# EAGLE design ders1 (EAGLE 9.6.2)
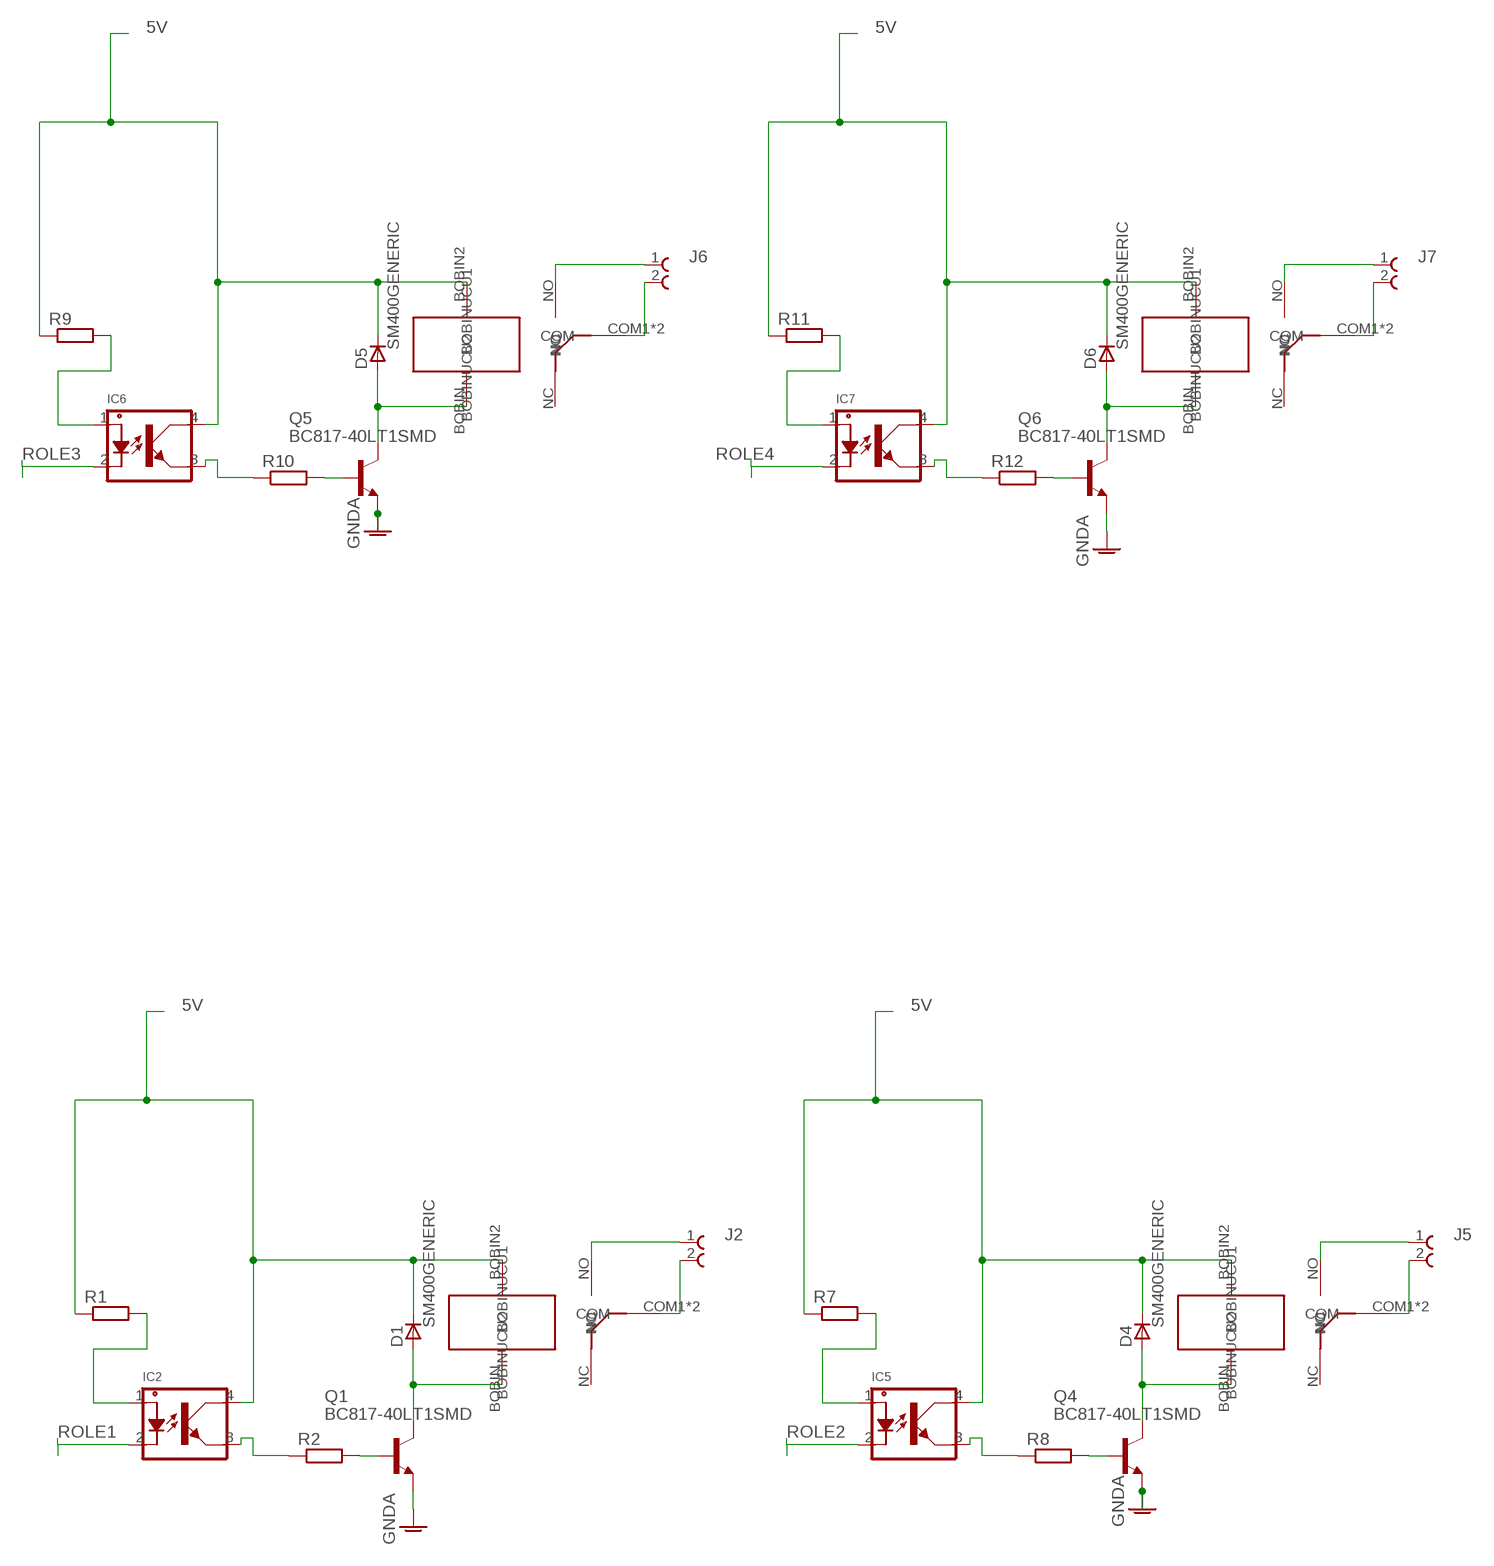
[diagram p0: schematic, sheet 1, part 1 of 2]
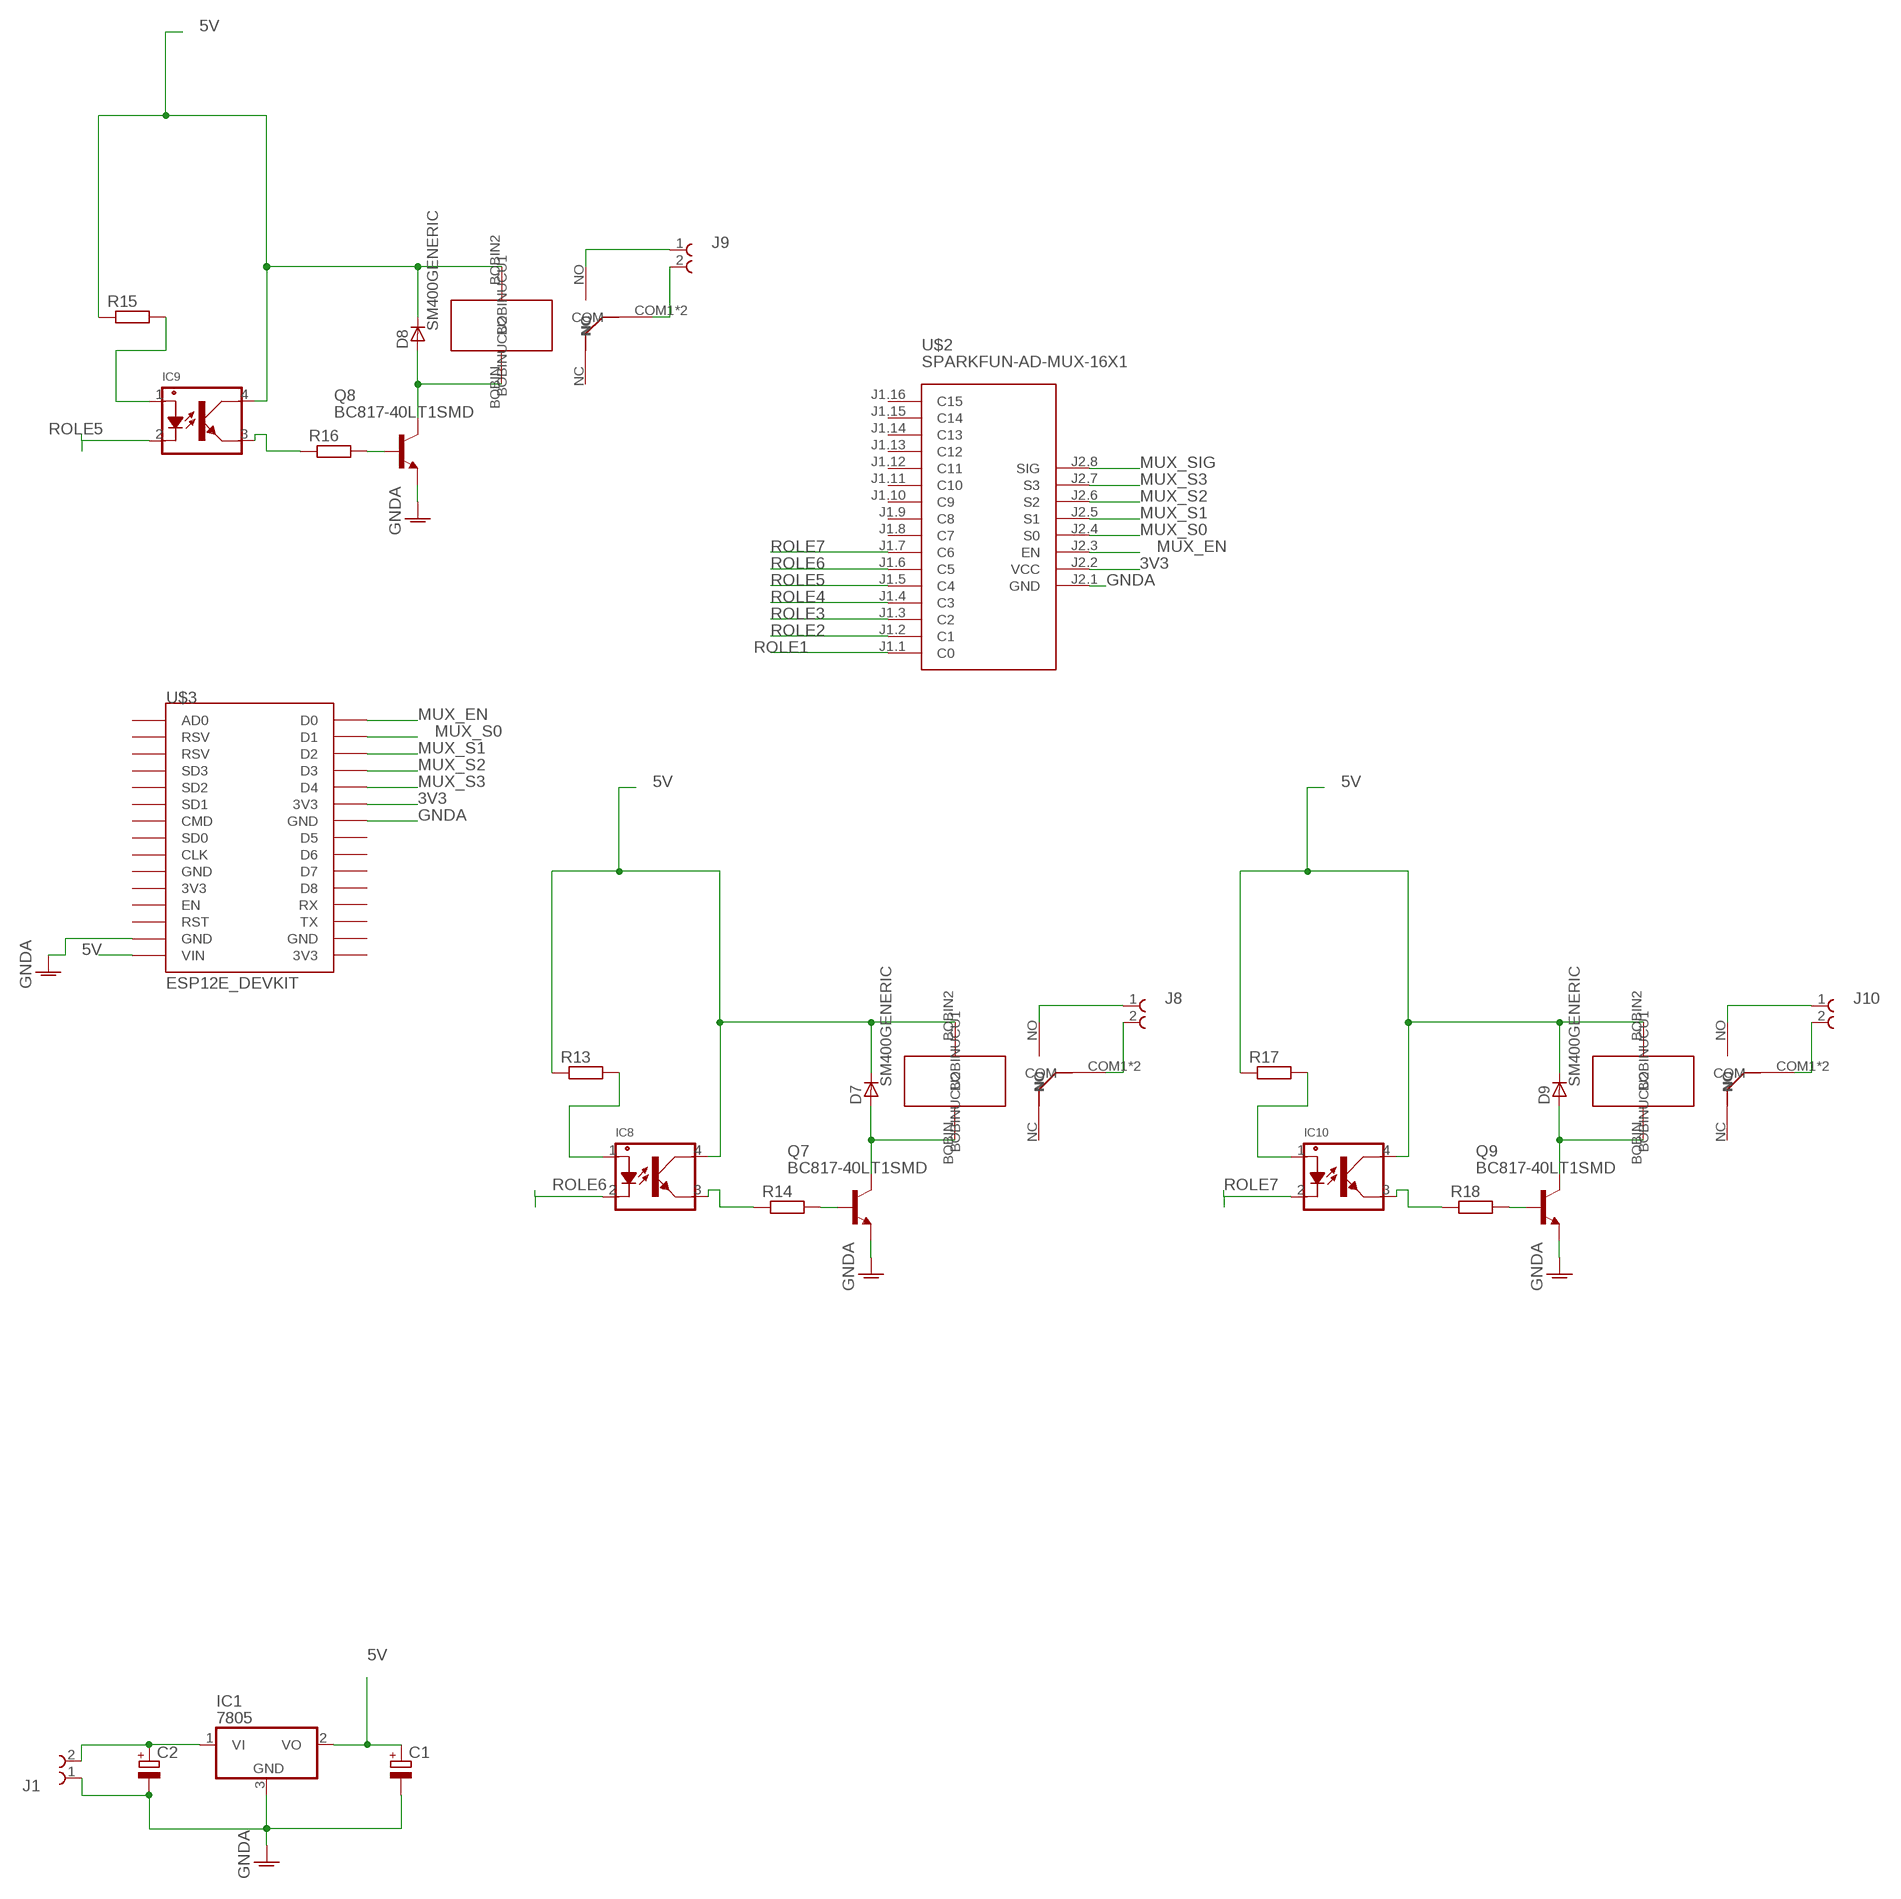
[diagram p1: schematic, sheet 1, part 2 of 2]

## Parts
C1  CPOL-EU153CLV-0405  [153CLV-0405]
C2  CPOL-EU153CLV-0405  [153CLV-0405]
D1  SM400GENERIC  [MELF-MLL41_DO213AB]
D4  SM400GENERIC  [MELF-MLL41_DO213AB]
D5  SM400GENERIC  [MELF-MLL41_DO213AB]
D6  SM400GENERIC  [MELF-MLL41_DO213AB]
D7  SM400GENERIC  [MELF-MLL41_DO213AB]
D8  SM400GENERIC  [MELF-MLL41_DO213AB]
D9  SM400GENERIC  [MELF-MLL41_DO213AB]
IC1  7805  [TO252]
IC2  LTV-817SMD  [SMD-4]
IC5  LTV-817SMD  [SMD-4]
IC6  LTV-817SMD  [SMD-4]
IC7  LTV-817SMD  [SMD-4]
IC8  LTV-817SMD  [SMD-4]
IC9  LTV-817SMD  [SMD-4]
IC10  LTV-817SMD  [SMD-4]
J1  691701540002B  [691701540002B]
J2  691701540002B  [691701540002B]
J5  691701540002B  [691701540002B]
J6  691701540002B  [691701540002B]
J7  691701540002B  [691701540002B]
J8  691701540002B  [691701540002B]
J9  691701540002B  [691701540002B]
J10  691701540002B  [691701540002B]
Q1  BC817-40LT1SMD  [SOT23-BEC]
Q4  BC817-40LT1SMD  [SOT23-BEC]
Q5  BC817-40LT1SMD  [SOT23-BEC]
Q6  BC817-40LT1SMD  [SOT23-BEC]
Q7  BC817-40LT1SMD  [SOT23-BEC]
Q8  BC817-40LT1SMD  [SOT23-BEC]
Q9  BC817-40LT1SMD  [SOT23-BEC]
R1  R-EU_R1206  [R1206]
R2  R-EU_R1206  [R1206]
R7  R-EU_R1206  [R1206]
R8  R-EU_R1206  [R1206]
R9  R-EU_R1206  [R1206]
R10  R-EU_R1206  [R1206]
R11  R-EU_R1206  [R1206]
R12  R-EU_R1206  [R1206]
R13  R-EU_R1206  [R1206]
R14  R-EU_R1206  [R1206]
R15  R-EU_R1206  [R1206]
R16  R-EU_R1206  [R1206]
R17  R-EU_R1206  [R1206]
R18  R-EU_R1206  [R1206]
U$1  HK23F-DC5V-SHG  [HK23F]
U$2  SPARKFUN-AD-MUX-16X1  [SPARKFUN-AD-MUX-16X1]
U$3  ESP12E_DEVKIT  [ESP12E_DEVKIT]
U$4  HK23F-DC5V-SHG  [HK23F]
U$5  HK23F-DC5V-SHG  [HK23F]
U$6  HK23F-DC5V-SHG  [HK23F]
U$7  HK23F-DC5V-SHG  [HK23F]
U$8  HK23F-DC5V-SHG  [HK23F]
U$9  HK23F-DC5V-SHG  [HK23F]

## Nets
3V3: U$2.J2.2(VCC) U$3.3V3@1(3V3)
5V: C1.+ D1.C D4.C D5.C D6.C D7.C D8.C D9.C IC1.2(VO) IC2.4 IC5.4 IC6.4 IC7.4 IC8.4 IC9.4 IC10.4 R1.1 R7.1 R9.1 R11.1 R13.1 R15.1 R17.1 U$1.BOBIN2(BOBINUCU2) U$3.VIN U$4.BOBIN2(BOBINUCU2) U$5.BOBIN2(BOBINUCU2) U$6.BOBIN2(BOBINUCU2) U$7.BOBIN2(BOBINUCU2) U$8.BOBIN2(BOBINUCU2) U$9.BOBIN2(BOBINUCU2)
GNDA: C1.- C2.- IC1.3(GND) J1.1 Q1.E Q4.E Q5.E Q6.E Q7.E Q8.E Q9.E U$2.J2.1(GND) U$3.GND@1(GND) U$3.GND@2(GND)
MUX_EN: U$2.J2.3(EN) U$3.D0
MUX_S0: U$2.J2.4(S0) U$3.D1
MUX_S1: U$2.J2.5(S1) U$3.D2
MUX_S2: U$2.J2.6(S2) U$3.D3
MUX_S3: U$2.J2.7(S3) U$3.D4
MUX_SIG: U$2.J2.8(SIG)
N$1: C2.+ IC1.1(VI) J1.2
N$3: D1.A Q1.C U$1.BOBIN(BOBINUCU1)
N$4: Q1.B R2.2
N$5: IC2.3 R2.1
N$6: IC2.1 R1.2
N$7: J2.2 U$1.COM1(COM) U$1.COM2(COM)
N$8: J2.1 U$1.NO
N$15: D4.A Q4.C U$4.BOBIN(BOBINUCU1)
N$22: Q4.B R8.2
N$23: IC5.3 R8.1
N$24: IC5.1 R7.2
N$25: J5.2 U$4.COM1(COM) U$4.COM2(COM)
N$26: J5.1 U$4.NO
N$27: D5.A Q5.C U$5.BOBIN(BOBINUCU1)
N$28: Q5.B R10.2
N$29: IC6.3 R10.1
N$30: IC6.1 R9.2
N$31: J6.2 U$5.COM1(COM) U$5.COM2(COM)
N$32: J6.1 U$5.NO
N$33: D6.A Q6.C U$6.BOBIN(BOBINUCU1)
N$34: Q6.B R12.2
N$35: IC7.3 R12.1
N$36: IC7.1 R11.2
N$37: J7.2 U$6.COM1(COM) U$6.COM2(COM)
N$38: J7.1 U$6.NO
N$39: D7.A Q7.C U$7.BOBIN(BOBINUCU1)
N$40: Q7.B R14.2
N$41: IC8.3 R14.1
N$42: IC8.1 R13.2
N$43: J8.2 U$7.COM1(COM) U$7.COM2(COM)
N$44: J8.1 U$7.NO
N$45: D8.A Q8.C U$8.BOBIN(BOBINUCU1)
N$46: Q8.B R16.2
N$47: IC9.3 R16.1
N$48: IC9.1 R15.2
N$49: J9.2 U$8.COM1(COM) U$8.COM2(COM)
N$50: J9.1 U$8.NO
N$51: D9.A Q9.C U$9.BOBIN(BOBINUCU1)
N$52: Q9.B R18.2
N$53: IC10.3 R18.1
N$54: IC10.1 R17.2
N$55: J10.2 U$9.COM1(COM) U$9.COM2(COM)
N$56: J10.1 U$9.NO
ROLE1: IC2.2 U$2.J1.1(C0)
ROLE2: IC5.2 U$2.J1.2(C1)
ROLE3: IC6.2 U$2.J1.3(C2)
ROLE4: IC7.2 U$2.J1.4(C3)
ROLE5: IC9.2 U$2.J1.5(C4)
ROLE6: IC8.2 U$2.J1.6(C5)
ROLE7: IC10.2 U$2.J1.7(C6)
Unconnected: U$1.NC U$2.J1.8(C7) U$2.J1.9(C8) U$2.J1.10(C9) U$2.J1.11(C10) U$2.J1.12(C11) U$2.J1.13(C12) U$2.J1.14(C13) U$2.J1.15(C14) U$2.J1.16(C15) U$3.3V3@0(3V3) U$3.3V3@2(3V3) U$3.AD0 U$3.CLK U$3.CMD U$3.D5 U$3.D6 U$3.D7 U$3.D8 U$3.EN U$3.GND@0(GND) U$3.GND@3(GND) U$3.RST U$3.RSV@0(RSV) U$3.RSV@1(RSV) U$3.RX U$3.SD0 U$3.SD1 U$3.SD2 U$3.SD3 U$3.TX U$4.NC U$5.NC U$6.NC U$7.NC U$8.NC U$9.NC

## Library data of the parts
C1 C2 = rcl:CPOL-EU: POLARIZED CAPACITOR, European symbol; SPICEPREFIX: C
D1 D4-D9 = _hhn_diodes_smd:SM400*: SM4001 .. SM4007 General Purpose Rectifier, 1 A SMD-Version of 1N4001 .. 1N4007 Case: MELF-MLL41 = DO 213 AB Author: Dipl.-Ing. FH Rainer Bayer HHN Hochschule Heilbronn, rainer.bayer@hs-heilbronn.de Ingenieurbüro ing-rb, mail@ing-rb.de
IC1 = Eagle Mixed Library:7805: Positive VOLTAGE REGULATOR Source: http://cache.national.com/ds/LM/LM78L05.pdf http://www.fairchildsemi.com/ds/LM/LM7805.pdf
IC2 IC5-IC10 = LTV-817:LTV-817: LTV-817 single channel optoisolator Package Part Number Price DIP-4 160-1366-5-ND <http://www.digikey.com/product-detail/en/LTV-817/160-1366-5-ND/385836> $0.39 SMD-4 160-1367-5-ND <http://www.digikey.com/product-detail/en/LTV-817S/160-1367-5-ND/385837> $0.40 channels: 1 isolation voltage: 5000Vrms power handling: 200mW response time: 4us @ 2v Input Voltage: 1.2-1.4v Datasheet <http://media.digikey.com/pdf/Data%20Sheets/Lite-On%20PDFs/LTV-817_827_847(M,S,S_TA1).pdf> Check prices <https://pricing.snapeda.com/parts/LTV-817/Lite-On%20Inc./view-part?ref=eda>; AVAILABILITY: Warning; DESCRIPTION: Optoisolator Transistor Output 5000Vrms 1 Channel 4-SMD; MF: Lite-On Inc.; MP: LTV-817; PACKAGE: DIP-4 Isocom; PRICE: None; PURCHASE-URL: https://pricing.snapeda.com/search/part/LTV-817/?ref=eda
J1 J2 J5-J10 = Wurth_Elektronik_Electromechanic_Terminal_Blocks_Connectors_rev16b:691701540002B: WR-TBL Serie 7015 – 5.08mm Close Horizontal PCB Header, 2 Pins=>Code : Con_TBL_Pluggable_5.08_PCB_THR_691701540002B <http://katalog.we-online.de/media/images/eican/Con_TBL_Pluggable_5.08_PCB_THR_6917015400xxB_pf2.jpg> Details see: http://katalog.we-online.de/en/em/691_701_540_0xxB Created 2014-06-25, Karrer Zheng 2014 (C) Würth Elektronik
Q1 Q4-Q9 = transistor-npn:BC817*: NPN Transistor
R1 R2 R7-R18 = rcl:R-EU_: RESISTOR, European symbol; SPICEPREFIX: R
U$1 U$4-U$9 = untitled:HK23F-DC5V-SHG
U$2 = diy-modules:SPARKFUN-AD-MUX-16X1: SparkFun Analog/Digital MUX Breakout based on CD74HC4067 chip Source: https://www.sparkfun.com/products/9056
U$3 = ESP12E_DEVKIT:ESP12E_DEVKIT: ESP12E DEVKIT BOARD

## Board
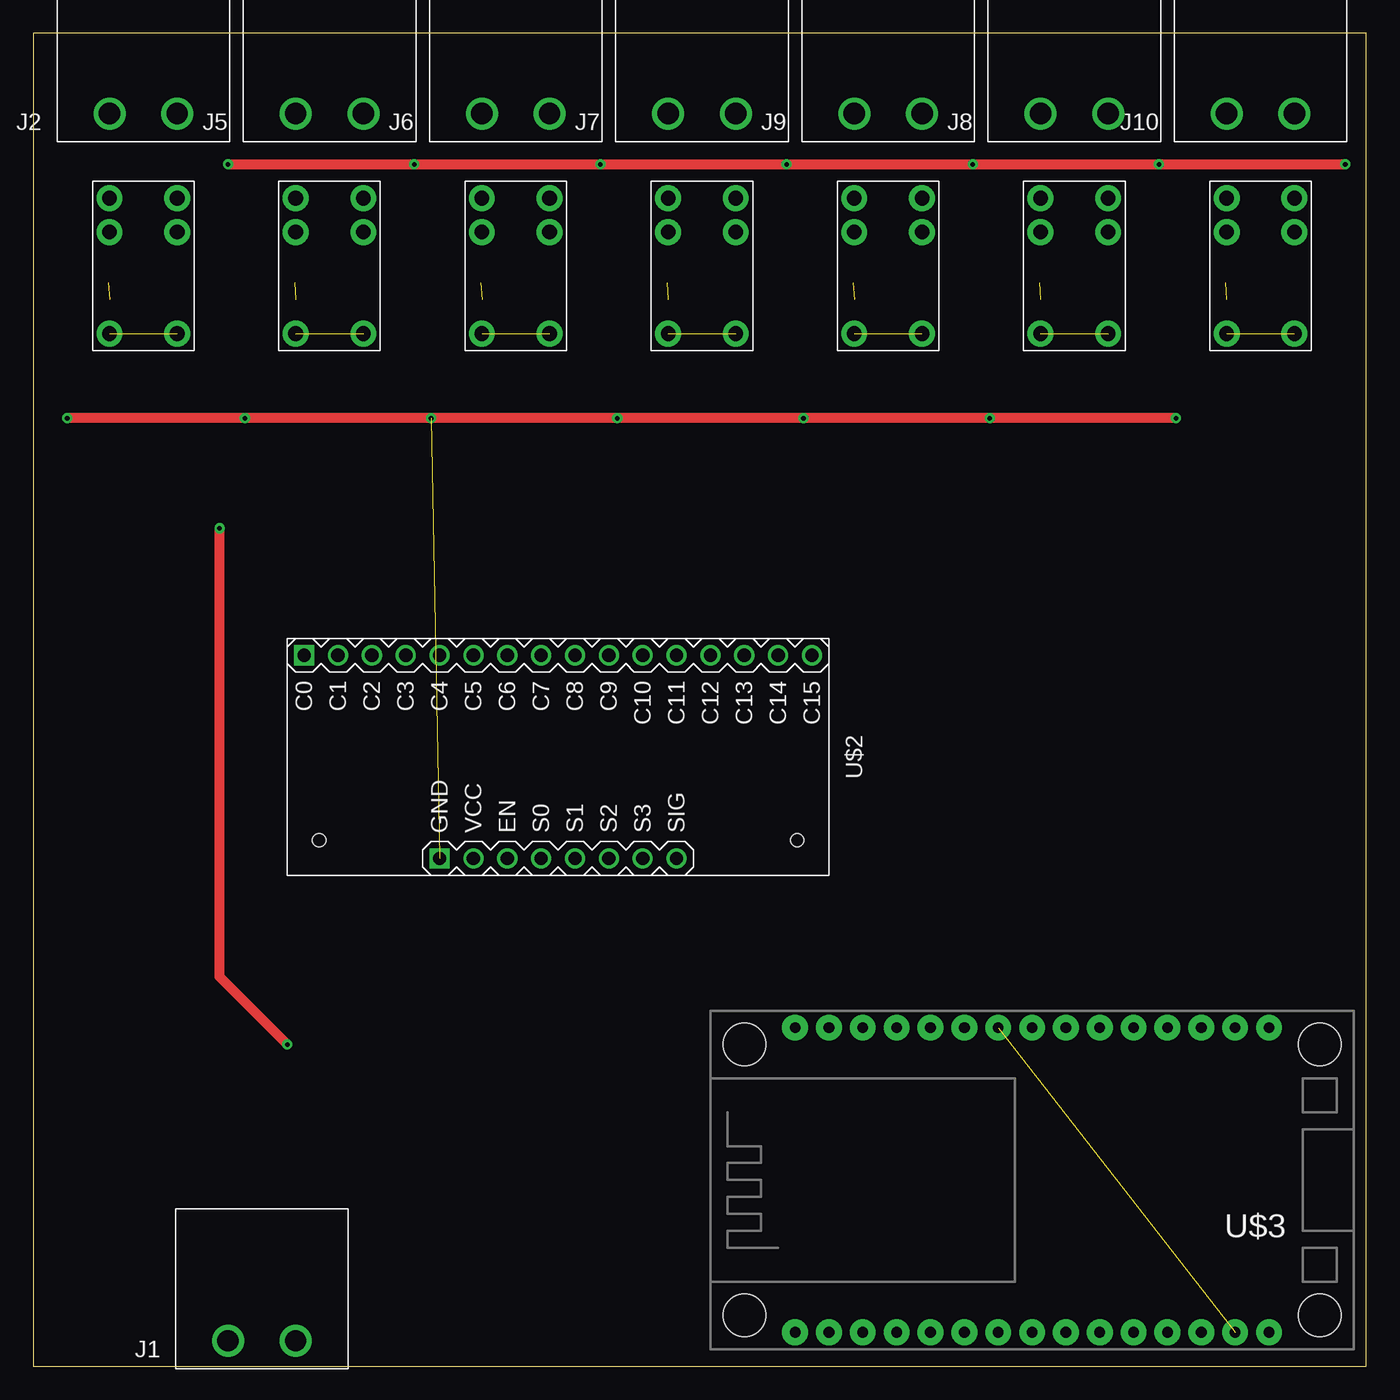
[diagram p2: board, top side]
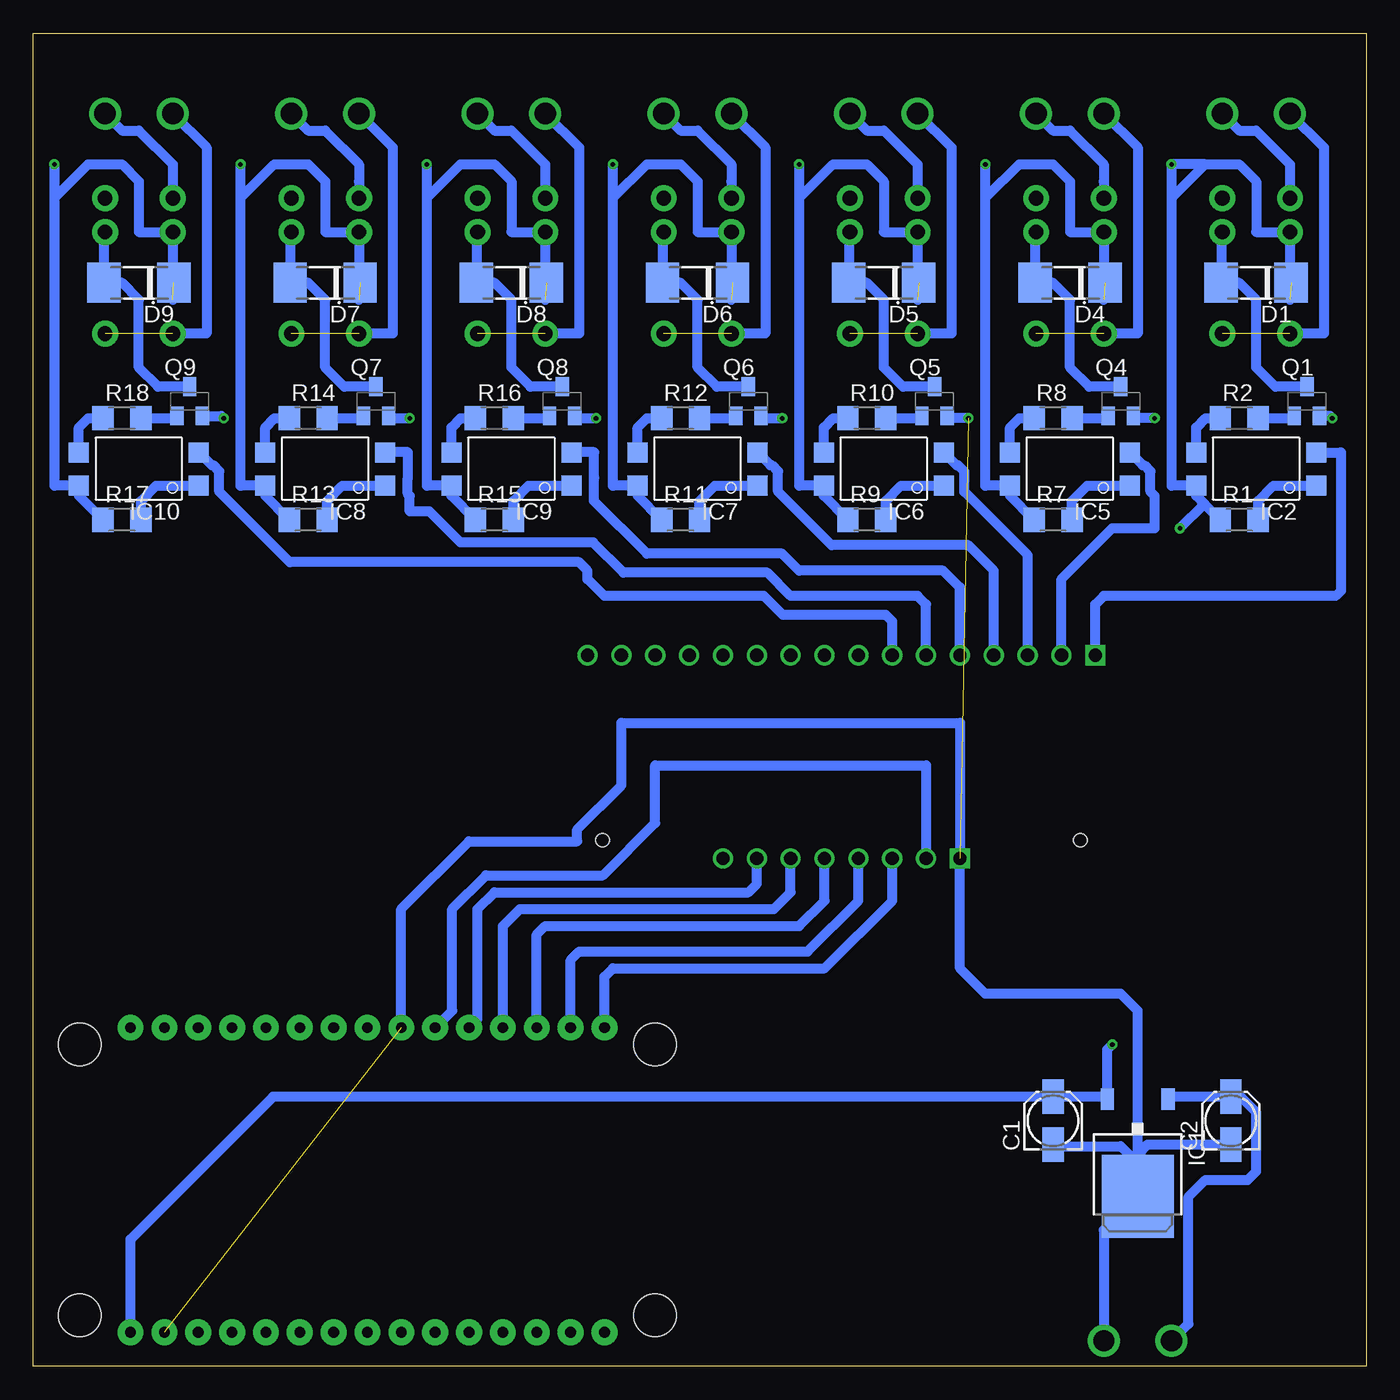
[diagram p3: board, bottom side, seen from below]

Size 100 x 100 mm. Coordinates in mm from the lower left corner, seen from the top.
Outline: 0,0 100,0 100,100 0,100 0,0
Copper layers (1*16): Top 0.035mm / dielectric 1.5mm / Bottom 0.035mm
Design rules "default": minimum track width 6mil, minimum drill 0.35mm, track to track 6mil, track to pad 6mil, pad to pad 6mil, via to via 6mil, smd to smd 6mil, copper to edge 40mil, drill to drill 6mil, minimum pad ring 10mil, minimum via ring 8mil, stop-mask expansion 4mil, vias tented up to drill 0mil, thermal gap 10mil

### Footprints (pad centres in the part's own frame; a part is rotated, then mirrored left to right if it is on the bottom)
153CLV-0405 = smd 2.6 x 1.6: + 1.8,0; - -1.8,0
MELF-MLL41_DO213AB = smd 2.5 x 3: A 2.625,0; C -2.625,0
TO252 = smd 1 x 1.6: 1 -2.28,-4.8; 2 2.28,-4.8 | smd 5.4 x 6.2: 3 0,2.5
SMD-4 = smd 1.5 x 1.5: 1 -1.25,-4.5; 2 1.25,-4.5; 3 1.25,4.5; 4 -1.25,4.5
691701540002B = drill 1.6: 1 -2.54,0; 2 2.54,0
SOT23-BEC = smd 1 x 1.4: B -0.95,-1.1; C 0,1.1; E 0.95,-1.1
R1206 = smd 1.6 x 1.803: 1 -1.422,0; 2 1.422,0
HK23F = drill 1.1 pad 1.93: BOBIN -10.16,5.08; BOBIN2 -10.16,0; COM1 -2.54,5.08; COM2 -2.54,0; NC -12.7,5.08; NO -12.7,0
SPARKFUN-AD-MUX-16X1 = drill 1 square: J1.1 -7.62,-19.05; J2.1 7.62,-8.89 | drill 1: J1.2 -7.62,-16.51; J1.3 -7.62,-13.97; J1.4 -7.62,-11.43; J1.5 -7.62,-8.89; J1.6 -7.62,-6.35; J1.7 -7.62,-3.81; J1.8 -7.62,-1.27; J1.9 -7.62,1.27; J1.10 -7.62,3.81; J1.11 -7.62,6.35; J1.12 -7.62,8.89; J1.13 -7.62,11.43; J1.14 -7.62,13.97; J1.15 -7.62,16.51; J1.16 -7.62,19.05; J2.2 7.62,-6.35; J2.3 7.62,-3.81; J2.4 7.62,-1.27; J2.5 7.62,1.27; J2.6 7.62,3.81; J2.7 7.62,6.35; J2.8 7.62,8.89 | hole 1: 6.245,-17.93; 6.245,17.93
ESP12E_DEVKIT = drill 0.8 pad 1.93: 3V3@0 -11.43,-7.62; 3V3@1 11.43,5.08; 3V3@2 11.43,-17.78; AD0 -11.43,17.78; CLK -11.43,-2.54; CMD -11.43,2.54; D0 11.43,17.78; D1 11.43,15.24; D2 11.43,12.7; D3 11.43,10.16; D4 11.43,7.62; D5 11.43,0; D6 11.43,-2.54; D7 11.43,-5.08; D8 11.43,-7.62; EN -11.43,-10.16; GND@0 -11.43,-5.08; GND@1 -11.43,-15.24; GND@2 11.43,2.54; GND@3 11.43,-15.24; RST -11.43,-12.7; RSV@0 -11.43,15.24; RSV@1 -11.43,12.7; RX 11.43,-10.16; SD0 -11.43,0; SD1 -11.43,5.08; SD2 -11.43,7.62; SD3 -11.43,10.16; TX 11.43,-12.7; VIN -11.43,-17.78 | hole 3.2: -10.16,21.59; 10.16,21.59; 10.16,-21.59; -10.16,-21.59

### Placement (x,y rotation side)
C1  23.5,18.41 90 bottom
C2  10.16,18.41 90 bottom
D1  8.26,81.28 180 bottom
D4  22.23,81.28 180 bottom
D5  36.2,81.28 180 bottom
D6  50.16,81.28 180 bottom
D7  78.11,81.28 180 bottom
D8  64.14,81.28 180 bottom
D9  92.08,81.28 180 bottom
IC1  17.14,15.24 180 bottom
IC2  8.26,67.31 90 bottom
IC5  22.23,67.31 90 bottom
IC6  36.2,67.31 90 bottom
IC7  50.16,67.31 90 bottom
IC8  78.11,67.31 90 bottom
IC9  64.14,67.31 90 bottom
IC10  92.08,67.31 90 bottom
J1  17.14,1.91 180 top
J2  8.26,93.98 180 top
J5  22.23,93.98 180 top
J6  36.2,93.98 180 top
J7  50.16,93.98 180 top
J8  78.11,93.98 180 top
J9  64.14,93.98 180 top
J10  92.08,93.98 180 top
Q1  4.45,72.39 0 bottom
Q4  18.41,72.39 0 bottom
Q5  32.38,72.39 0 bottom
Q6  46.35,72.39 0 bottom
Q7  74.3,72.39 0 bottom
Q8  60.33,72.39 0 bottom
Q9  88.27,72.39 0 bottom
R1  9.53,63.5 0 bottom
R2  9.53,71.12 0 bottom
R7  23.5,63.5 0 bottom
R8  23.5,71.12 0 bottom
R9  37.47,63.5 0 bottom
R10  37.47,71.12 0 bottom
R11  51.44,63.5 0 bottom
R12  51.44,71.12 0 bottom
R13  79.38,63.5 0 bottom
R14  79.38,71.12 0 bottom
R15  65.41,63.5 0 bottom
R16  65.41,71.12 0 bottom
R17  93.34,63.5 0 bottom
R18  93.34,71.12 0 bottom
U$1  5.71,74.93 270 top
U$2  39.37,45.72 270 top
U$3  74.93,13.97 90 top
U$4  19.68,74.93 270 top
U$5  33.66,74.93 270 top
U$6  47.62,74.93 270 top
U$7  75.56,74.93 270 top
U$8  61.59,74.93 270 top
U$9  89.53,74.93 270 top

### Tracks (layer width: path | path; a pad name or v marks a point on that pad's centre or on a via)
3V3
  Bottom 0.762: U$3.3V3@1 68.58,26.67 68.58,34.29 66.04,36.83 57.26,36.83 53.34,40.75 53.34,45.09 33.02,45.09 U$2.J2.2
5V  (via drill 0.35)  (7 unrouted)
  Top 0.762: v19.05,24.13 13.97,29.21 v13.97,62.87 | v14.61,90.17 v28.57,90.17 v42.55,90.17 v56.52,90.17 v70.48,90.17 v84.45,90.17 v98.42,90.17
  Bottom 0.762: R1.1 12.14,64.69 | 12.14,64.69 12.76,65.31 IC2.4 14.59,66.06 | 14.59,66.06 14.61,66.04 | 14.59,66.06 14.59,87 14.59,87.65 | 12.06,90.17 9.53,90.17 8.26,88.9 8.26,85.09 U$1.BOBIN2 5.71,80.01 | 14.59,87.65 12.06,90.17 | R7.1 26.73,65.31 IC5.4 28.55,66.06 | 28.55,66.06 28.57,66.04 | 28.55,66.06 28.55,87.65 | 28.55,87.65 26.04,90.17 23.5,90.17 22.23,88.9 22.23,85.09 U$4.BOBIN2 19.68,80.01 | R9.1 40.7,65.31 IC6.4 42.52,66.06 | 42.52,66.06 42.55,66.04 | 42.52,66.06 42.52,87.65 | 42.52,87.65 40.01,90.17 37.47,90.17 36.2,88.9 36.2,85.09 U$5.BOBIN2 33.66,80.01 | R11.1 54.66,65.31 IC7.4 56.49,66.06 | 56.49,66.06 56.52,66.04 | 56.49,66.06 56.49,87.65 | 56.49,87.65 53.98,90.17 51.44,90.17 50.16,88.9 50.16,85.09 U$6.BOBIN2 47.62,80.01 | R15.1 68.64,65.31 IC9.4 70.47,66.06 | 70.47,66.06 70.48,66.04 | 70.47,66.06 70.47,87.65 | 70.47,87.65 67.94,90.17 65.41,90.17 64.14,88.9 64.14,85.09 U$8.BOBIN2 61.59,80.01 | R13.1 82.61,65.31 IC8.4 84.44,66.06 | 84.44,66.06 84.45,66.04 | 84.44,66.06 84.44,87.65 | 84.44,87.65 81.92,90.17 79.38,90.17 78.11,88.9 78.11,85.09 U$7.BOBIN2 75.56,80.01 | R17.1 96.58,65.31 IC10.4 98.41,66.06 | 98.41,66.06 98.42,66.04 | 98.41,66.06 98.41,86.36 | 98.41,86.36 98.41,87.65 95.89,90.17 93.34,90.17 92.08,88.9 92.08,85.09 U$9.BOBIN2 89.53,80.01 | U$3.VIN 92.71,9.53 82.02,20.21 C1.+ 19.6,20.21 IC1.2 19.43,23.75 v19.05,24.13 | v13.97,62.87 12.14,64.69 | 12.06,90.17 v14.61,90.17 14.59,90.15 14.59,87.65 | v98.42,90.17 98.42,86.38 98.41,86.36 | 84.44,87.65 84.44,90.15 v84.45,90.17 | 70.47,87.65 70.47,90.15 v70.48,90.17 | 56.49,87.65 56.49,90.15 v56.52,90.17 | 42.52,87.65 42.52,90.15 v42.55,90.17
  Bottom 0.762: 28.55,87.65 28.57,87.67 v28.57,90.17
GNDA  (via drill 0.35)  (2 unrouted)
  Top 0.762: v85.72,71.12 v71.75,71.12 v57.78,71.12 v43.81,71.12 v29.84,71.12 v15.88,71.12 v2.54,71.12
  Bottom 0.762: Q9.E 85.89,71.29 v85.72,71.12 | Q7.E 73.17,71.12 v71.75,71.12 | Q8.E 59.2,71.12 v57.78,71.12 | Q6.E 45.23,71.12 v43.81,71.12 | v29.84,71.12 31.27,71.12 Q5.E | v15.88,71.12 17.3,71.12 Q4.E | v2.54,71.12 2.71,71.29 Q1.E | U$3.GND@2 72.39,34.29 67.31,39.37 59.2,39.37 59.2,40.26 55.88,43.58 55.88,48.26 30.48,48.26 U$2.J2.1 30.48,29.84 28.57,27.94 18.41,27.94 17.14,26.67 IC1.3 | C2.- 16.41,16.61 17.14,15.88 IC1.3 | C1.- 23.39,16.51 18.41,16.51 17.14,15.24 IC1.3 | IC1.3 19.68,10.2 J1.1
MUX_EN
  Bottom 0.762: U$3.D0 57.15,29.21 56.52,29.84 40.64,29.84 35.56,34.92 U$2.J2.3
MUX_S0
  Bottom 0.762: U$3.D1 59.69,30.48 59.05,31.11 41.91,31.11 38.1,34.92 U$2.J2.4
MUX_S1
  Bottom 0.762: U$3.D2 62.23,32.38 61.59,33.02 42.55,33.02 40.64,34.92 U$2.J2.5
MUX_S2
  Bottom 0.762: U$3.D3 64.77,33.02 63.5,34.29 44.45,34.29 43.18,35.56 U$2.J2.6
MUX_S3
  Bottom 0.762: U$3.D4 66.67,26.04 66.67,34.29 65.41,35.56 46.35,35.56 45.72,36.2 U$2.J2.7
N$1
  Bottom 0.762: IC1.1 14.69,20.21 C2.+ 9.42,20.21 8.26,19.05 8.26,14.61 8.89,13.97 12.06,13.97 13.34,12.7 13.34,3.17 J1.2
N$3
  Bottom 0.762: D1.A 10.88,81.03 | Q1.C 6.82,73.49 8.26,74.93 8.26,80.01 9.53,81.28 D1.A | U$1.BOBIN 10.88,85 D1.A
N$4
  Bottom 0.762: R2.2 5.57,71.12 Q1.B
N$5
  Bottom 0.762: IC2.3 12.76,70.43 12.06,71.12 R2.1
N$6
  Bottom 0.762: R1.2 8.1,64.92 6.96,66.06 IC2.1
N$7  (1 unrouted)
  Bottom 0.762: J2.2 3.17,91.44 3.17,77.47 U$1.COM2
N$8
  Bottom 0.762: 5.71,88.9 U$1.NO 5.71,90.17 8.26,92.71 9.53,92.71 J2.1
N$15
  Bottom 0.762: D4.A 24.85,81.03 | Q4.C 20.79,73.49 22.23,74.93 22.23,80.01 23.5,81.28 D4.A | U$4.BOBIN 24.85,85 D4.A
N$22
  Bottom 0.762: R8.2 19.54,71.12 Q4.B
N$23
  Bottom 0.762: IC5.3 26.73,70.43 26.04,71.12 R8.1
N$24
  Bottom 0.762: R7.2 22.07,64.92 20.93,66.06 IC5.1
N$25  (1 unrouted)
  Bottom 0.762: J5.2 17.14,91.44 17.14,77.47 U$4.COM2
N$26
  Bottom 0.762: 19.68,88.9 U$4.NO 19.68,90.17 22.23,92.71 23.5,92.71 J5.1
N$27
  Bottom 0.762: D5.A 38.82,81.03 | Q5.C 34.76,73.49 36.2,74.93 36.2,80.01 37.47,81.28 D5.A | U$5.BOBIN 38.82,85 D5.A
N$28
  Bottom 0.762: R10.2 33.51,71.12 Q5.B
N$29
  Bottom 0.762: IC6.3 40.7,70.43 40.01,71.12 R10.1
N$30
  Bottom 0.762: R9.2 36.04,64.92 34.91,66.06 IC6.1
N$31  (1 unrouted)
  Bottom 0.762: J6.2 31.11,91.44 31.11,77.47 U$5.COM2
N$32
  Bottom 0.762: 33.66,88.9 U$5.NO 33.66,90.17 36.2,92.71 37.47,92.71 J6.1
N$33
  Bottom 0.762: D6.A 52.79,81.03 | Q6.C 48.73,73.49 50.16,74.93 50.16,80.01 51.44,81.28 D6.A | U$6.BOBIN 52.79,85 D6.A
N$34
  Bottom 0.762: R12.2 47.48,71.12 Q6.B
N$35
  Bottom 0.762: IC7.3 54.66,70.43 53.98,71.12 R12.1
N$36
  Bottom 0.762: R11.2 50.01,64.92 48.88,66.06 IC7.1
N$37  (1 unrouted)
  Bottom 0.762: J7.2 45.09,91.44 45.09,77.47 U$6.COM2
N$38
  Bottom 0.762: 47.62,88.9 U$6.NO 47.62,90.17 50.16,92.71 51.44,92.71 J7.1
N$39
  Bottom 0.762: D7.A 80.73,81.03 | Q7.C 76.67,73.49 78.11,74.93 78.11,80.01 79.38,81.28 D7.A | U$7.BOBIN 80.73,85 D7.A
N$40
  Bottom 0.762: R14.2 75.42,71.12 Q7.B
N$41
  Bottom 0.762: IC8.3 82.61,70.43 81.92,71.12 R14.1
N$42
  Bottom 0.762: R13.2 77.95,64.92 76.81,66.06 IC8.1
N$43  (1 unrouted)
  Bottom 0.762: J8.2 73.03,91.44 73.03,77.47 U$7.COM2
N$44
  Bottom 0.762: 75.56,88.9 U$7.NO 75.56,90.17 78.11,92.71 79.38,92.71 J8.1
N$45
  Bottom 0.762: D8.A 66.76,81.03 | Q8.C 62.7,73.49 64.14,74.93 64.14,80.01 65.41,81.28 D8.A | U$8.BOBIN 66.76,85 D8.A
N$46
  Bottom 0.762: R16.2 61.45,71.12 Q8.B
N$47
  Bottom 0.762: IC9.3 68.64,70.43 67.94,71.12 R16.1
N$48
  Bottom 0.762: R15.2 63.98,64.92 62.84,66.06 IC9.1
N$49  (1 unrouted)
  Bottom 0.762: J9.2 59.05,91.44 59.05,77.47 U$8.COM2
N$50
  Bottom 0.762: 61.59,88.9 U$8.NO 61.59,90.17 64.14,92.71 65.41,92.71 J9.1
N$51
  Bottom 0.762: D9.A 94.7,81.03 | Q9.C 90.64,73.49 92.08,74.93 92.08,80.01 93.34,81.28 D9.A | U$9.BOBIN 94.7,85 D9.A
N$52
  Bottom 0.762: R18.2 89.39,71.12 Q9.B
N$53
  Bottom 0.762: IC10.3 96.58,70.43 95.89,71.12 R18.1
N$54
  Bottom 0.762: R17.2 91.92,64.92 90.78,66.06 IC10.1
N$55  (1 unrouted)
  Bottom 0.762: J10.2 87,91.44 87,77.47 U$9.COM2
N$56
  Bottom 0.762: 89.53,88.9 U$9.NO 89.53,90.17 92.08,92.71 93.34,92.71 J10.1
ROLE1
  Bottom 0.762: U$2.J1.1 20.32,57.15 19.68,57.78 2.29,57.78 1.91,58.17 1.91,68.58 1.93,68.56 IC2.2
ROLE2
  Bottom 0.762: 17.46,68.82 IC5.2 16.76,67.6 16.65,67.6 16.19,67.14 16.19,65.61 15.88,65.3 15.88,62.87 19.05,62.87 22.86,59.05 U$2.J1.2
ROLE3
  Bottom 0.762: 31.43,68.82 IC6.2 30.73,67.6 30.62,67.6 30.16,67.14 30.16,65.61 25.4,60.85 U$2.J1.3
ROLE4
  Bottom 0.762: 45.41,68.82 IC7.2 44.7,67.6 44.59,67.6 44.13,67.14 44.13,65.61 40.11,61.59 29.84,61.59 27.94,59.69 U$2.J1.4
ROLE5
  Bottom 0.762: 59.38,68.82 IC9.2 59.62,68.58 57.92,68.58 57.92,66.65 57.94,66.63 57.94,64.92 53.98,60.96 43.81,60.96 42.55,59.69 31.75,59.69 30.48,58.42 U$2.J1.5
ROLE6
  Bottom 0.762: 73.34,68.82 IC8.2 73.58,68.58 71.89,68.58 71.89,66.65 71.91,66.63 71.91,65.45 71.75,65.3 71.75,64.14 70.28,64.14 67.95,61.81 58,61.81 55.73,59.54 44.93,59.54 43.18,57.78 33.66,57.78 33.02,57.15 U$2.J1.6
ROLE7
  Bottom 0.762: 87.31,68.82 IC10.2 86.61,67.6 86.5,67.6 86.04,67.14 86.04,65.61 80.75,60.33 59.05,60.33 58.42,59.69 58.42,59.05 57.15,57.78 45.19,57.78 43.77,56.36 36.04,56.36 35.56,55.88 U$2.J1.7